# EAGLE schematic reegan-brd (EAGLE 7.7.0)
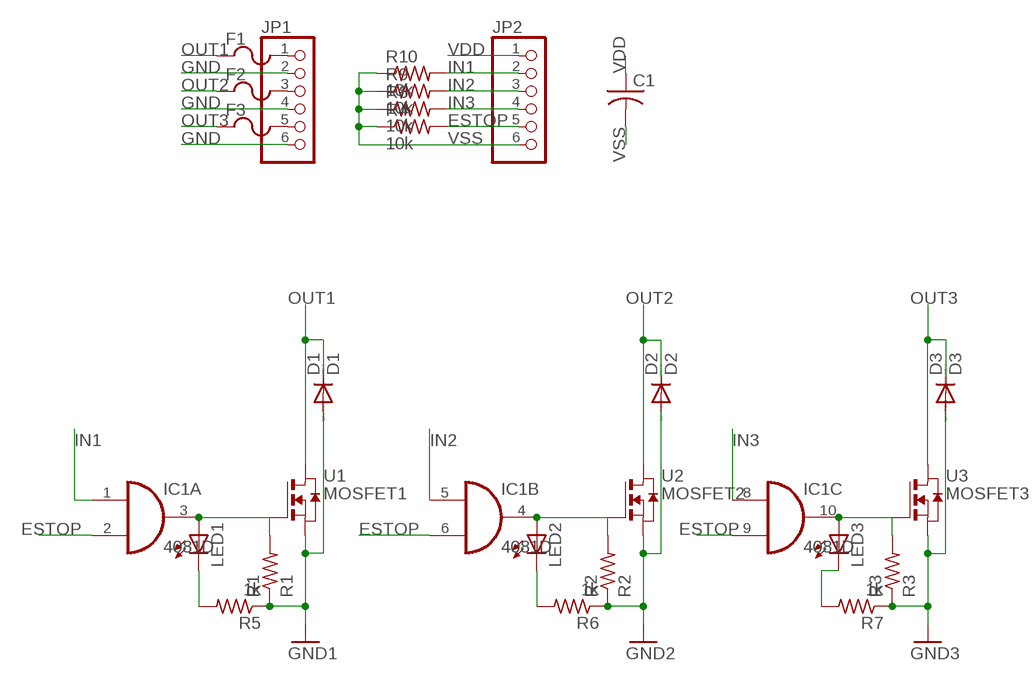
[diagram p0: schematic, sheet 1]

## Parts
C1  C-USC0603  [C0603]
D1  D1  1N4004  [DO41-10]
D2  D2  1N4004  [DO41-10]
D3  D3  1N4004  [DO41-10]
F1  POLYFUSE  [1206]
F2  POLYFUSE  [1206]
F3  POLYFUSE  [1206]
IC1  4081D  [SO14]
JP1  PINHD-1X6  [1X06]
JP2  PINHD-1X6  [1X06]
LED1  LEDCHIPLED_0603  [CHIPLED_0603]
LED2  LEDCHIPLED_0603  [CHIPLED_0603]
LED3  LEDCHIPLED_0603  [CHIPLED_0603]
R1  R1  R-US_R0603  [R0603]
R2  R2  R-US_R0603  [R0603]
R3  R3  R-US_R0603  [R0603]
R4  10k  R-US_R0603  [R0603]
R5  1k  R-US_R0603  [R0603]
R6  1k  R-US_R0603  [R0603]
R7  1k  R-US_R0603  [R0603]
R8  10k  R-US_R0603  [R0603]
R9  10k  R-US_R0603  [R0603]
R10  10k  R-US_R0603  [R0603]
U1  MOSFET1  MOSFET  [MOSFET]
U2  MOSFET2  MOSFET  [MOSFET]
U3  MOSFET3  MOSFET  [MOSFET]

## Nets
ESTOP: IC1.2(A:I1) IC1.6(B:I1) IC1.9(C:I1) JP2.5 R4.2
GND: D1.A D2.A D3.A JP1.2 JP1.4 JP1.6 R1.1 R2.1 R3.1 R5.1 R6.1 R7.1 U1.P$3(S) U2.P$3(S) U3.P$3(S) ; supply symbol labelled GND2, GND1, GND3
IN1: IC1.1(A:I0) JP2.2 R10.2
IN2: IC1.5(B:I0) JP2.3 R9.2
IN3: IC1.8(C:I0) JP2.4 R8.2
N$1: IC1.3(A:O) LED1.A R1.2 U1.P$1(G)
N$4: IC1.4(B:O) LED2.A R2.2 U2.P$1(G)
N$6: IC1.10(C:O) LED3.A R3.2 U3.P$1(G)
N$7: F1.2 JP1.1
N$8: F2.2 JP1.3
N$9: F3.2 JP1.5
N$10: LED1.C R5.2
N$11: LED2.C R6.2
N$12: LED3.C R7.2
OUT1: D1.C F1.1 U1.P$2(D)
OUT2: D2.C F2.1 U2.P$2(D)
OUT3: D3.C F3.1 U3.P$2(D)
VDD: C1.1 JP2.1
VSS: C1.2 JP2.6 R4.1 R8.1 R9.1 R10.1
Unconnected: IC1.11(D:O) IC1.12(D:I0) IC1.13(D:I1)

## Power pins joined to a net without a drawn wire
VDD: IC1.14(P:VDD)
VSS: IC1.7(P:VSS)

## Library data of the parts
C1 = E-P-008-R1.2:C-US: CAPACITOR, American symbol
D1-D3 = diode:1N4004: DIODE general purpose rectifier, 1 A
F1-F3 = polyfuse:POLYFUSE: Resistor Basic schematic elements and footprints for 0603, 1206, and PTH resistors.
IC1 = 40xx:4081: Quad 2-input AND
JP1 JP2 = adafruit:PINHD-1X6: PIN HEADER
LED1-LED3 = adafruit:LED: LED OSRAM: - CHIPLED LG R971, LG N971, LY N971, LG Q971, LY Q971, LO R971, LY R971 LH N974, LH R974 LS Q976, LO Q976, LY Q976 LO Q996 - Hyper CHIPLED LW Q18S LB Q993, LB Q99A, LB R99A - SideLED LS A670, LO A670, LY A670, LG A670, LP A670 LB A673, LV A673, LT A673, LW A673 LH A674 LY A675 LS A676, LA A676, LO A676, LY A676, LW A676 LS A679, LY A679, LG A679 - Hyper Micro SIDELED® LS Y876, LA Y876, LO Y876, LY Y876 LT Y87S - SmartLED LW L88C, LW L88S LB L89C, LB L89S, LG L890 LS L89K, LO L89K, LY L89K LS L896, LA L896, LO L896, LY L896 - TOPLED LS T670, LO T670, LY T670, LG T670, LP T670 LSG T670, LSP T670, LSY T670, LOP T670, LYG T670 LG T671, LOG T671, LSG T671 LB T673, LV T673, LT T673, LW T673 LH T674 LS T676, LA T676, LO T676, LY T676, LB T676, LH T676, LSB T676, LW T676 LB T67C, LV T67C, LT T67C, LS T67K, LO T67K, LY T67K, LW E67C LS E67B, LA E67B, LO E67B, LY E67B, LB E67C, LV E67C, LT E67C LW T67C LS T679, LY T679, LG T679 LS T770, LO T770, LY T770, LG T770, LP T770 LB T773, LV T773, LT T773, LW T773 LH T774 LS E675, LA E675, LY E675, LS T675 LS T776, LA T776, LO T776, LY T776, LB T776 LHGB T686 LT T68C, LB T68C - Hyper Mini TOPLED® LB M676 - Mini TOPLED Santana® LG M470 LS M47K, LO M47K, LY M47K Source: http://www.osram.convergy.de/
R1-R3 R5-R7 = resistor:R-US_: RESISTOR, American symbol
R4 R8-R10 = adafruit:R-US_: RESISTOR, American symbol
U1-U3 = MOSFET:MOSFET